# EAGLE design OPA_1_1 (EAGLE 7.6.0)
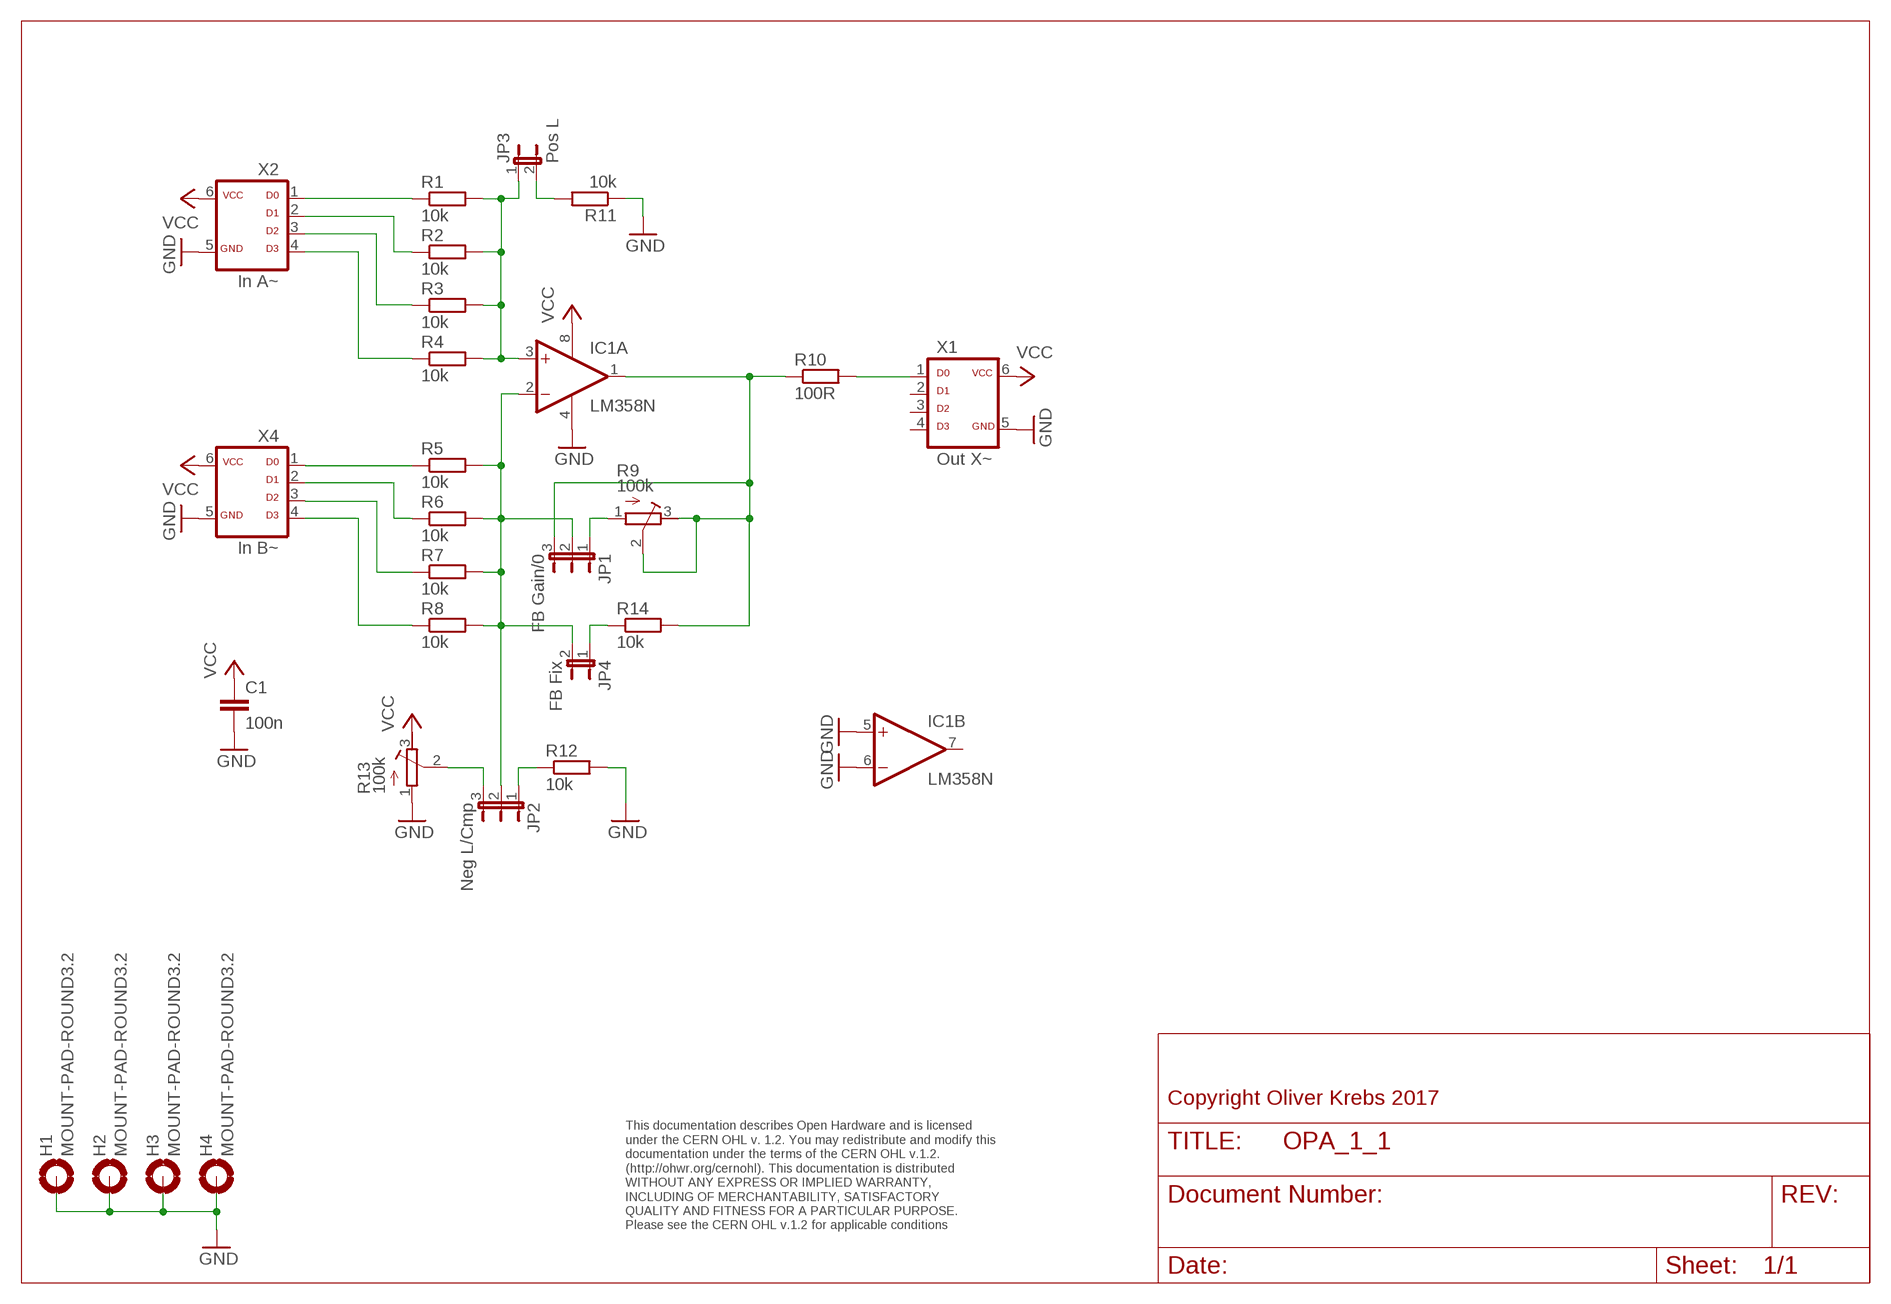
[diagram p0: schematic, sheet 1]

## Parts
C1  100n  C-EU050-025X075  [C050-025X075]
H1  MOUNT-PAD-ROUND3.2  [3,2-PAD]
H2  MOUNT-PAD-ROUND3.2  [3,2-PAD]
H3  MOUNT-PAD-ROUND3.2  [3,2-PAD]
H4  MOUNT-PAD-ROUND3.2  [3,2-PAD]
IC1  LM358N  [DIL08]
JP1  FB Gain/0  JP2EJP2-U  [JP2-U]
JP2  Neg L/Cmp  JP2EJP2-U  [JP2-U]
JP3  Pos L  JP1E  [JP1]
JP4  FB Fix  JP1E  [JP1]
R1  10k  R-EU_0207/10  [0207/10]
R2  10k  R-EU_0207/10  [0207/10]
R3  10k  R-EU_0207/10  [0207/10]
R4  10k  R-EU_0207/10  [0207/10]
R5  10k  R-EU_0207/10  [0207/10]
R6  10k  R-EU_0207/10  [0207/10]
R7  10k  R-EU_0207/10  [0207/10]
R8  10k  R-EU_0207/10  [0207/10]
R9  100k  R-TRIMMACP  [ACP-6L]
R10  100R  R-EU_0207/10  [0207/10]
R11  10k  R-EU_0207/10  [0207/10]
R12  10k  R-EU_0207/10  [0207/10]
R13  100k  R-TRIMMACP  [ACP-6L]
R14  10k  R-EU_0207/10  [0207/10]
X1  Out X~  ML6D  [ML-6]
X2  In A~  ML6D  [ML-6]
X4  In B~  ML6D  [ML-6]

## Nets
GND: C1.2 H1.B3,2(MOUNT) H2.B3,2(MOUNT) H3.B3,2(MOUNT) H4.B3,2(MOUNT) IC1.4(P:V-) IC1.5(B:+IN) IC1.6(B:-IN) R11.1 R12.2 R13.1(A) X1.5 X2.5 X4.5
N$1: JP2.1 R12.1
N$2: IC1.2(A:-IN) JP1.2 JP2.2 JP4.2 R5.2 R6.2 R7.2 R8.2
N$3: R1.1 X2.1
N$4: R2.1 X2.2
N$5: IC1.3(A:+IN) JP3.1 R1.2 R2.2 R3.2 R4.2
N$6: R10.2 X1.1
N$7: JP1.1 R9.1(A)
N$8: R3.1 X2.3
N$10: R4.1 X2.4
N$11: R5.1 X4.1
N$12: R6.1 X4.2
N$13: R7.1 X4.3
N$14: R8.1 X4.4
N$15: JP2.3 R13.2(S)
N$16: IC1.1(A:OUT) JP1.3 R9.2(S) R9.3(E) R10.1 R14.2
N$17: JP3.2 R11.2
N$18: JP4.1 R14.1
VCC: C1.1 IC1.8(P:V+) R13.3(E) X1.6 X2.6 X4.6
Unconnected: IC1.7(B:OUT) X1.2 X1.3 X1.4

## Notes on the sheet
- Copyright Oliver Krebs 2017
- This documentation describes Open Hardware and is licensed 
  under the CERN OHL v. 1.2. You may redistribute and modify this 
  documentation under the terms of the CERN OHL v.1.2. 
  (http://ohwr.org/cernohl). This documentation is distributed
  WITHOUT ANY EXPRESS OR IMPLIED WARRANTY, 
  INCLUDING OF MERCHANTABILITY, SATISFACTORY 
  QUALITY AND FITNESS FOR A PARTICULAR PURPOSE. 
  Please see the CERN OHL v.1.2 for applicable conditions

## Library data of the parts
C1 = 01-my_rcl:C-EU: CAPACITOR, European symbol
H1-H4 = holes:MOUNT-PAD-ROUND: MOUNTING PAD, round
IC1 = 01-my-linear:LM358: OP AMP also LM158; LM258; LM2904 Source: http://cache.national.com/ds/LM/LM158.pdf
JP1 JP2 = 01-my-jumper:JP2E: JUMPER
JP3 JP4 = jumper:JP1E: JUMPER
R1-R8 R10-R12 R14 = 01-my_rcl:R-EU_: RESISTOR, European symbol
R9 R13 = 01-my_rcl:R-TRIMM: Trimm resistor
X1 X2 X4 = 01-my-con:ML6D

## Board
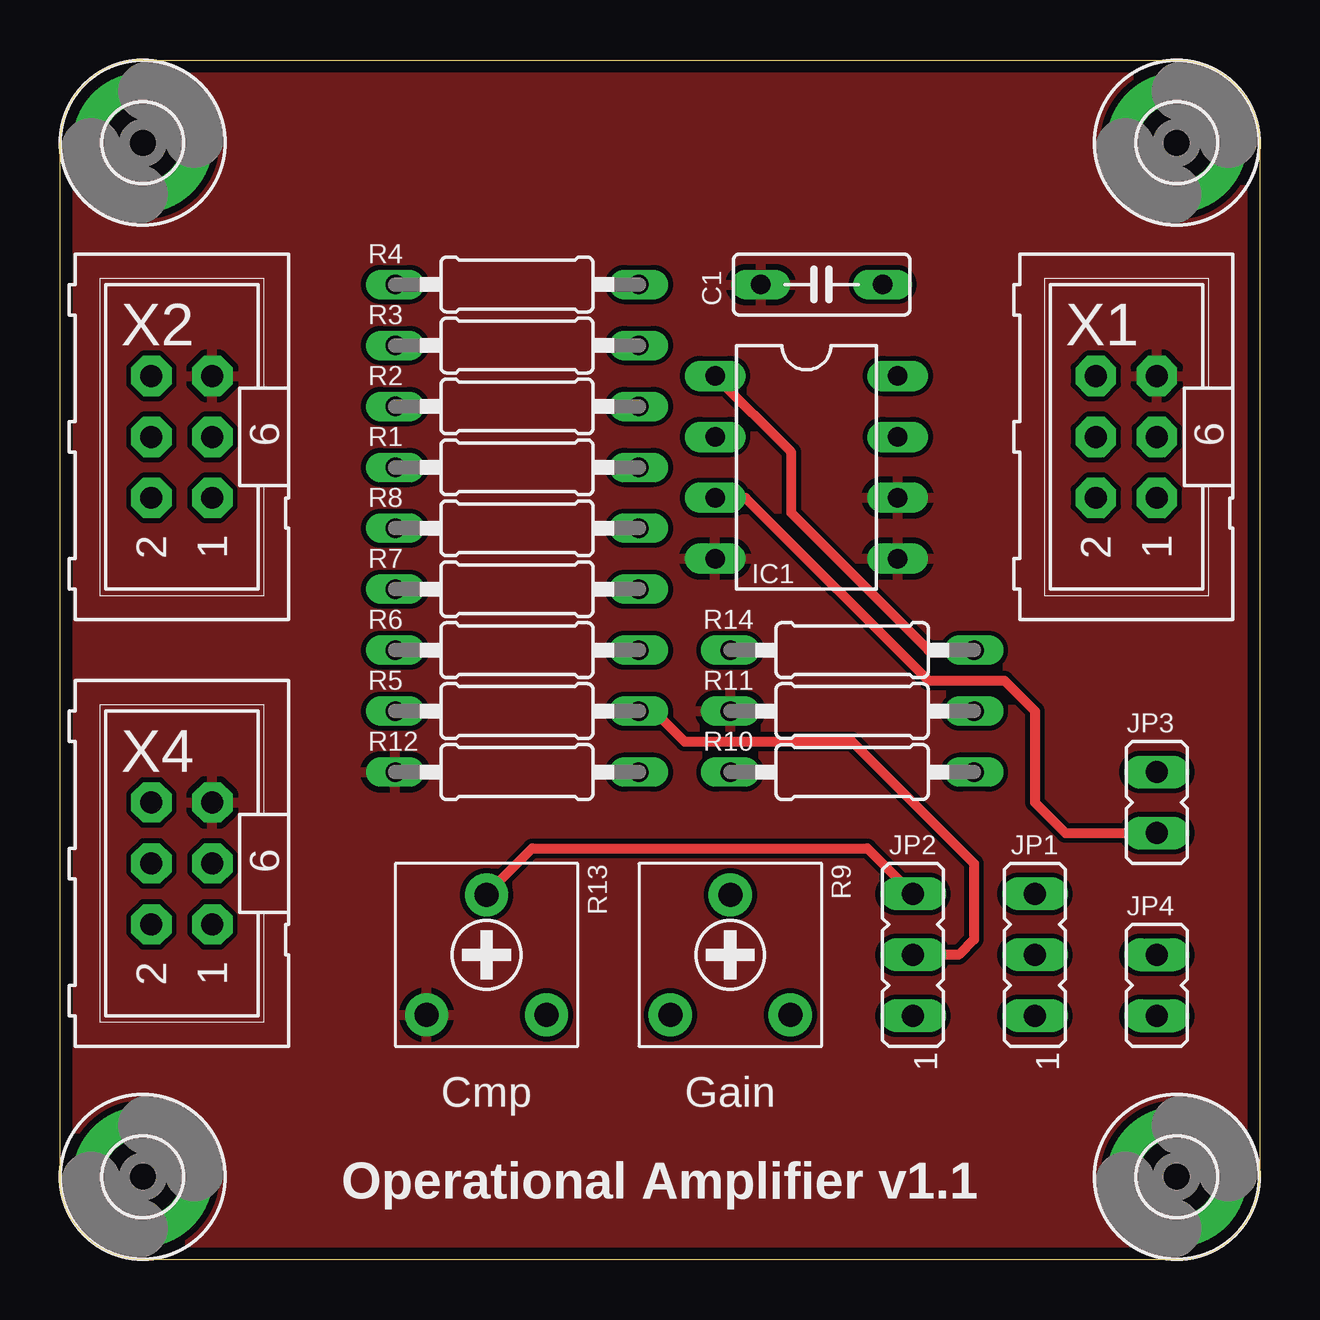
[diagram p1: board, top side]
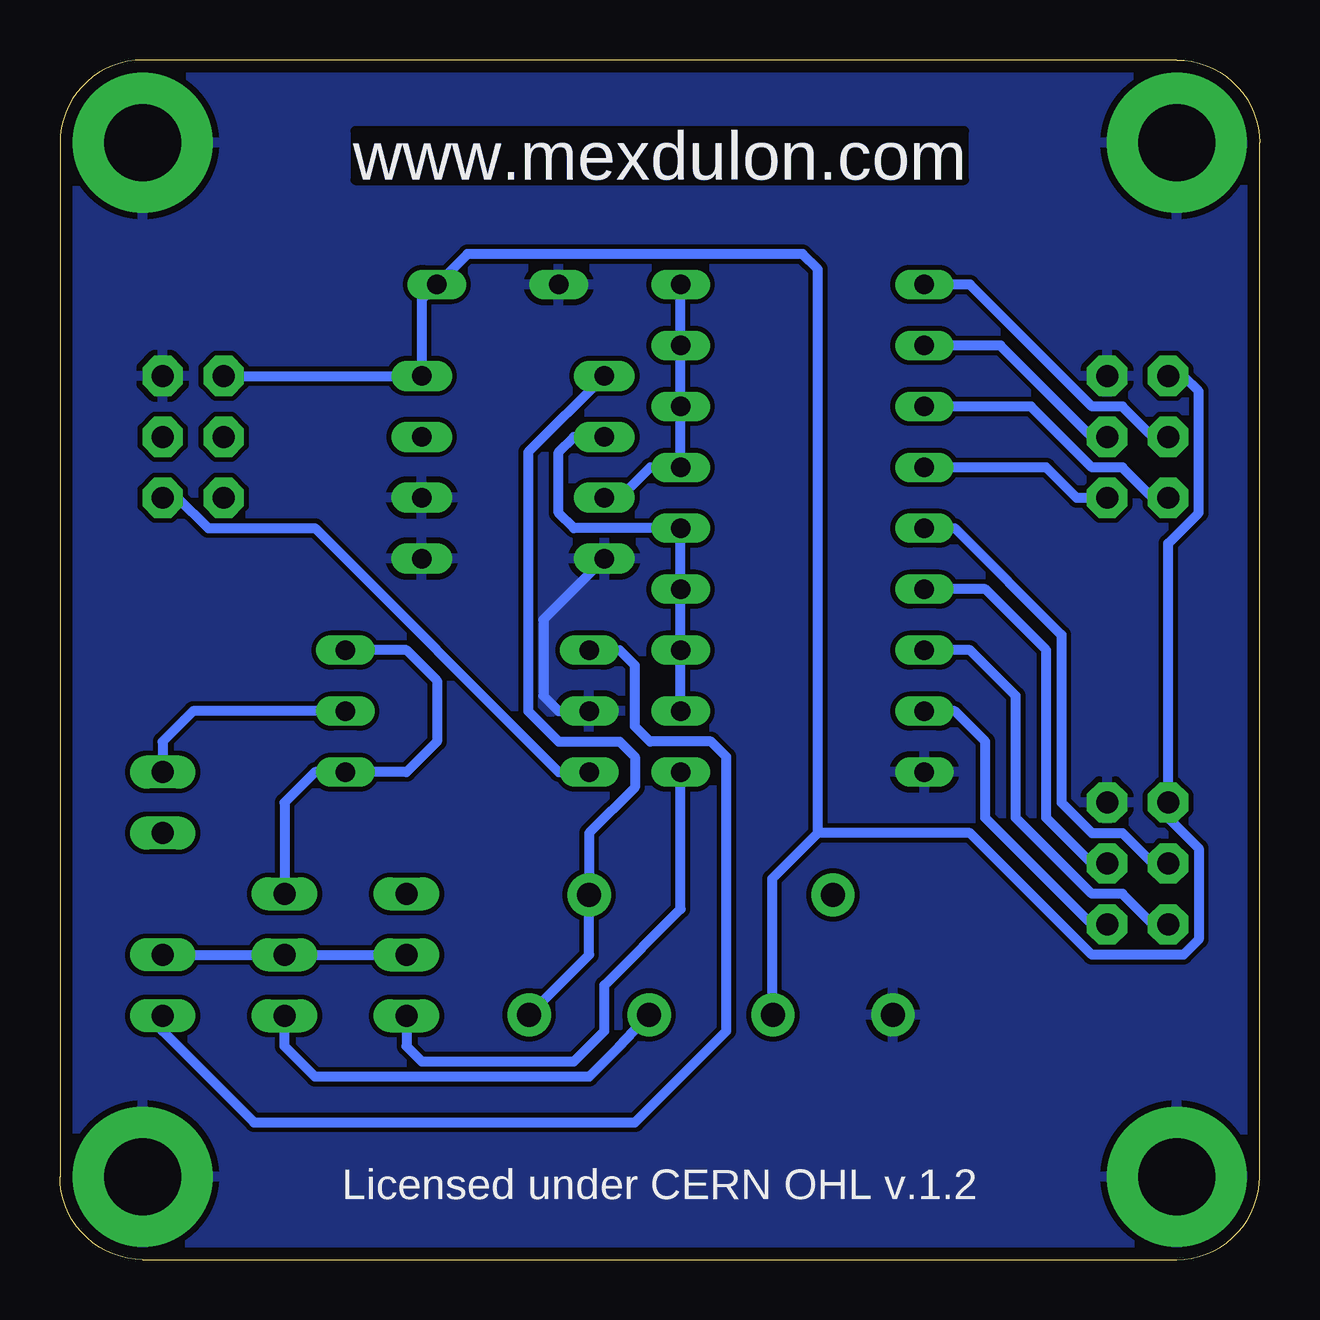
[diagram p2: board, bottom side, seen from below]

Size 50 x 50 mm. Coordinates in mm from the lower left corner, seen from the top.
Outline: 0,3.45 0,46.55 arc-90 3.45,50 46.55,50 arc-90 50,46.55 50,3.45 arc-90 46.55,0 3.45,0 arc-90 0,3.45
Copper layers (1*16): Top 0.035mm / dielectric 1.6mm / Bottom 0.035mm
Design rules "Elecrow_2-layer_PCB_eagle_rule": minimum track width 6mil, minimum drill 12mil, track to track 6mil, track to pad 6mil, pad to pad 6mil, via to via 8mil, smd to smd 0mil, copper to edge 20mil, drill to drill 10mil, minimum pad ring 6mil, minimum via ring 6mil, stop-mask expansion 0mil, vias tented up to drill 100mil, thermal gap 10mil

### Footprints (pad centres in the part's own frame; a part is rotated, then mirrored left to right if it is on the bottom)
C050-025X075 = drill 0.813 long: 1 -2.54,0; 2 2.54,0
3,2-PAD = drill 3.2 pad 5.842: B3,2 0,0
DIL08 = drill 0.813 pad 1.27 long: 1 -3.81,-3.81; 2 -1.27,-3.81; 3 1.27,-3.81; 4 3.81,-3.81; 5 3.81,3.81; 6 1.27,3.81; 7 -1.27,3.81; 8 -3.81,3.81
JP2-U = drill 0.914 long: 1 -2.54,0; 2 0,0; 3 2.54,0
JP1 = drill 0.914 long: 1 0,-1.27; 2 0,1.27
0207/10 = drill 0.813 long: 1 -5.08,0; 2 5.08,0
ACP-6L = drill 1 pad 1.8: 1 -2.5,-2.5; 2 0,2.5; 3 2.5,-2.5
ML-6 = drill 0.914 pad 1.676 octagon: 1 -2.54,-1.27; 2 -2.54,1.27; 3 0,-1.27; 4 0,1.27; 5 2.54,-1.27; 6 2.54,1.27

### Placement (x,y rotation side)
C1  31.75,40.64 180 top
H1  3.45,3.45 0 top
H2  3.45,46.55 0 top
H3  46.55,46.55 0 top
H4  46.55,3.45 0 top
IC1  31.11,33.02 270 top
JP1  40.64,12.7 90 top
JP2  35.56,12.7 90 top
JP3  45.72,19.05 0 top
JP4  45.72,11.43 0 top
R1  19.05,33.02 0 top
R2  19.05,35.56 0 top
R3  19.05,38.1 0 top
R4  19.05,40.64 0 top
R5  19.05,22.86 0 top
R6  19.05,25.4 0 top
R7  19.05,27.94 0 top
R8  19.05,30.48 0 top
R9  27.94,12.7 0 top
R10  33.02,20.32 180 top
R11  33.02,22.86 0 top
R12  19.05,20.32 180 top
R13  17.78,12.7 0 top
R14  33.02,25.4 0 top
X1  44.45,34.29 90 top
X2  5.08,34.29 90 top
X4  5.08,16.51 90 top

### Tracks (layer width: path | path; a pad name or v marks a point on that pad's centre or on a via)
GND
  Bottom 0.406: IC1.4 29.84,26.67 29.84,23.5 29.21,22.86 R11.1
  pour Bottom (isolate 0.203): 0,50.16 50.8,50.16 50.8,0 0,0
  pour Top (isolate 0.203): 0,50.16 50.8,50.16 50.8,0 0,0
N$1
  Bottom 0.406: JP2.1 35.56,8.89 34.92,8.26 28.57,8.26 27.3,9.53 27.3,11.43 24.13,14.61 R12.1
N$2
  Top 0.406: R5.2 24.77,22.86 26.04,21.59 33.02,21.59 38.1,16.51 38.1,13.34 37.47,12.7 JP2.2
  Bottom 0.406: R5.2 R6.2 R7.2 R8.2 28.57,30.48 29.21,31.11 29.21,33.66 28.57,34.29 IC1.2 | JP4.2 JP1.2 JP2.2
N$3
  Bottom 0.406: X2.1 7.62,31.75 8.89,33.02 R1.1
N$4
  Bottom 0.406: X2.2 4.45,31.75 5.71,33.02 6.99,33.02 9.53,35.56 R2.1
N$5
  Top 0.406: IC1.3 28.57,31.75 36.2,24.13 39.37,24.13 40.64,22.86 40.64,19.05 41.91,17.78 JP3.1
  Bottom 0.406: R4.2 R3.2 R2.2 R1.2 25.4,33.02 26.67,31.75 IC1.3
N$6
  Bottom 0.406: X1.1 45.09,31.75 43.81,30.48 39.37,30.48 29.21,20.32 R10.2
N$7
  Bottom 0.406: R9.1 26.71,8.85 27.94,7.62 39.37,7.62 40.64,8.89 JP1.1
N$8
  Bottom 0.406: X2.3 6.99,34.29 10.79,38.1 R3.1
N$10
  Bottom 0.406: X2.4 4.45,34.29 5.71,35.56 6.99,35.56 12.06,40.64 R4.1
N$11
  Bottom 0.406: X4.1 6.99,13.97 11.43,18.41 11.43,21.59 12.7,22.86 R5.1
N$12
  Bottom 0.406: X4.2 4.45,13.97 5.71,15.24 6.99,15.24 10.16,18.41 10.16,23.5 12.06,25.4 R6.1
N$13
  Bottom 0.406: X4.3 6.99,16.51 8.89,18.41 8.89,25.4 11.43,27.94 R7.1
N$14
  Bottom 0.406: R8.1 12.7,30.48 8.26,26.04 8.26,19.05 6.99,17.78 5.71,17.78 4.45,16.51 X4.4
N$15
  Top 0.406: R13.2 17.74,15.2 19.68,17.14 33.66,17.14 JP2.3
N$16  (via drill 0.6)
  Top 0.406: R14.2 36.2,25.4 30.48,31.11 30.48,33.66 IC1.1
  Bottom 0.406: IC1.1 30.48,33.66 30.48,22.86 29.21,21.59 26.67,21.59 26.04,20.95 26.04,19.68 27.94,17.78 R9.2 27.94,12.7 R9.3 | JP1.3 40.64,19.05 39.37,20.32 R10.1 35.56,20.32 34.29,21.59 34.29,24.13 35.56,25.4 R14.2
  other vias: 38.1,25.4
N$17
  Bottom 0.406: R11.2 44.45,22.86 45.72,21.59 JP3.2
N$18
  Bottom 0.406: JP4.1 45.72,9.53 41.91,5.71 26.04,5.71 22.23,9.53 22.23,20.95 22.86,21.59 25.4,21.59 26.04,22.23 26.04,24.77 26.67,25.4 R14.1
VCC
  Bottom 0.406: X2.6 3.17,36.83 2.54,36.2 2.54,31.11 3.81,29.84 X4.6 3.81,18.41 2.54,17.14 2.54,13.34 3.17,12.7 6.99,12.7 12.06,17.78 18.41,17.78 | X1.6 IC1.8 34.92,40.01 C1.1 33.02,41.91 19.05,41.91 18.41,41.27 18.41,17.78 | 18.41,17.78 20.32,15.88 20.32,10.24 R13.3

### Text on the board
Bottom: www.mexdulon.com
tNames: Cmp | Gain | Operational Amplifier v1.1
bNames: www.mexdulon.com | Licensed under CERN OHL v.1.2
200bmp: E:/Bilder/Elektronik/Modulion/Mexdulon/mexdulon_50x50_pcb.bmp